# EAGLE design Droplet (EAGLE 6.1)
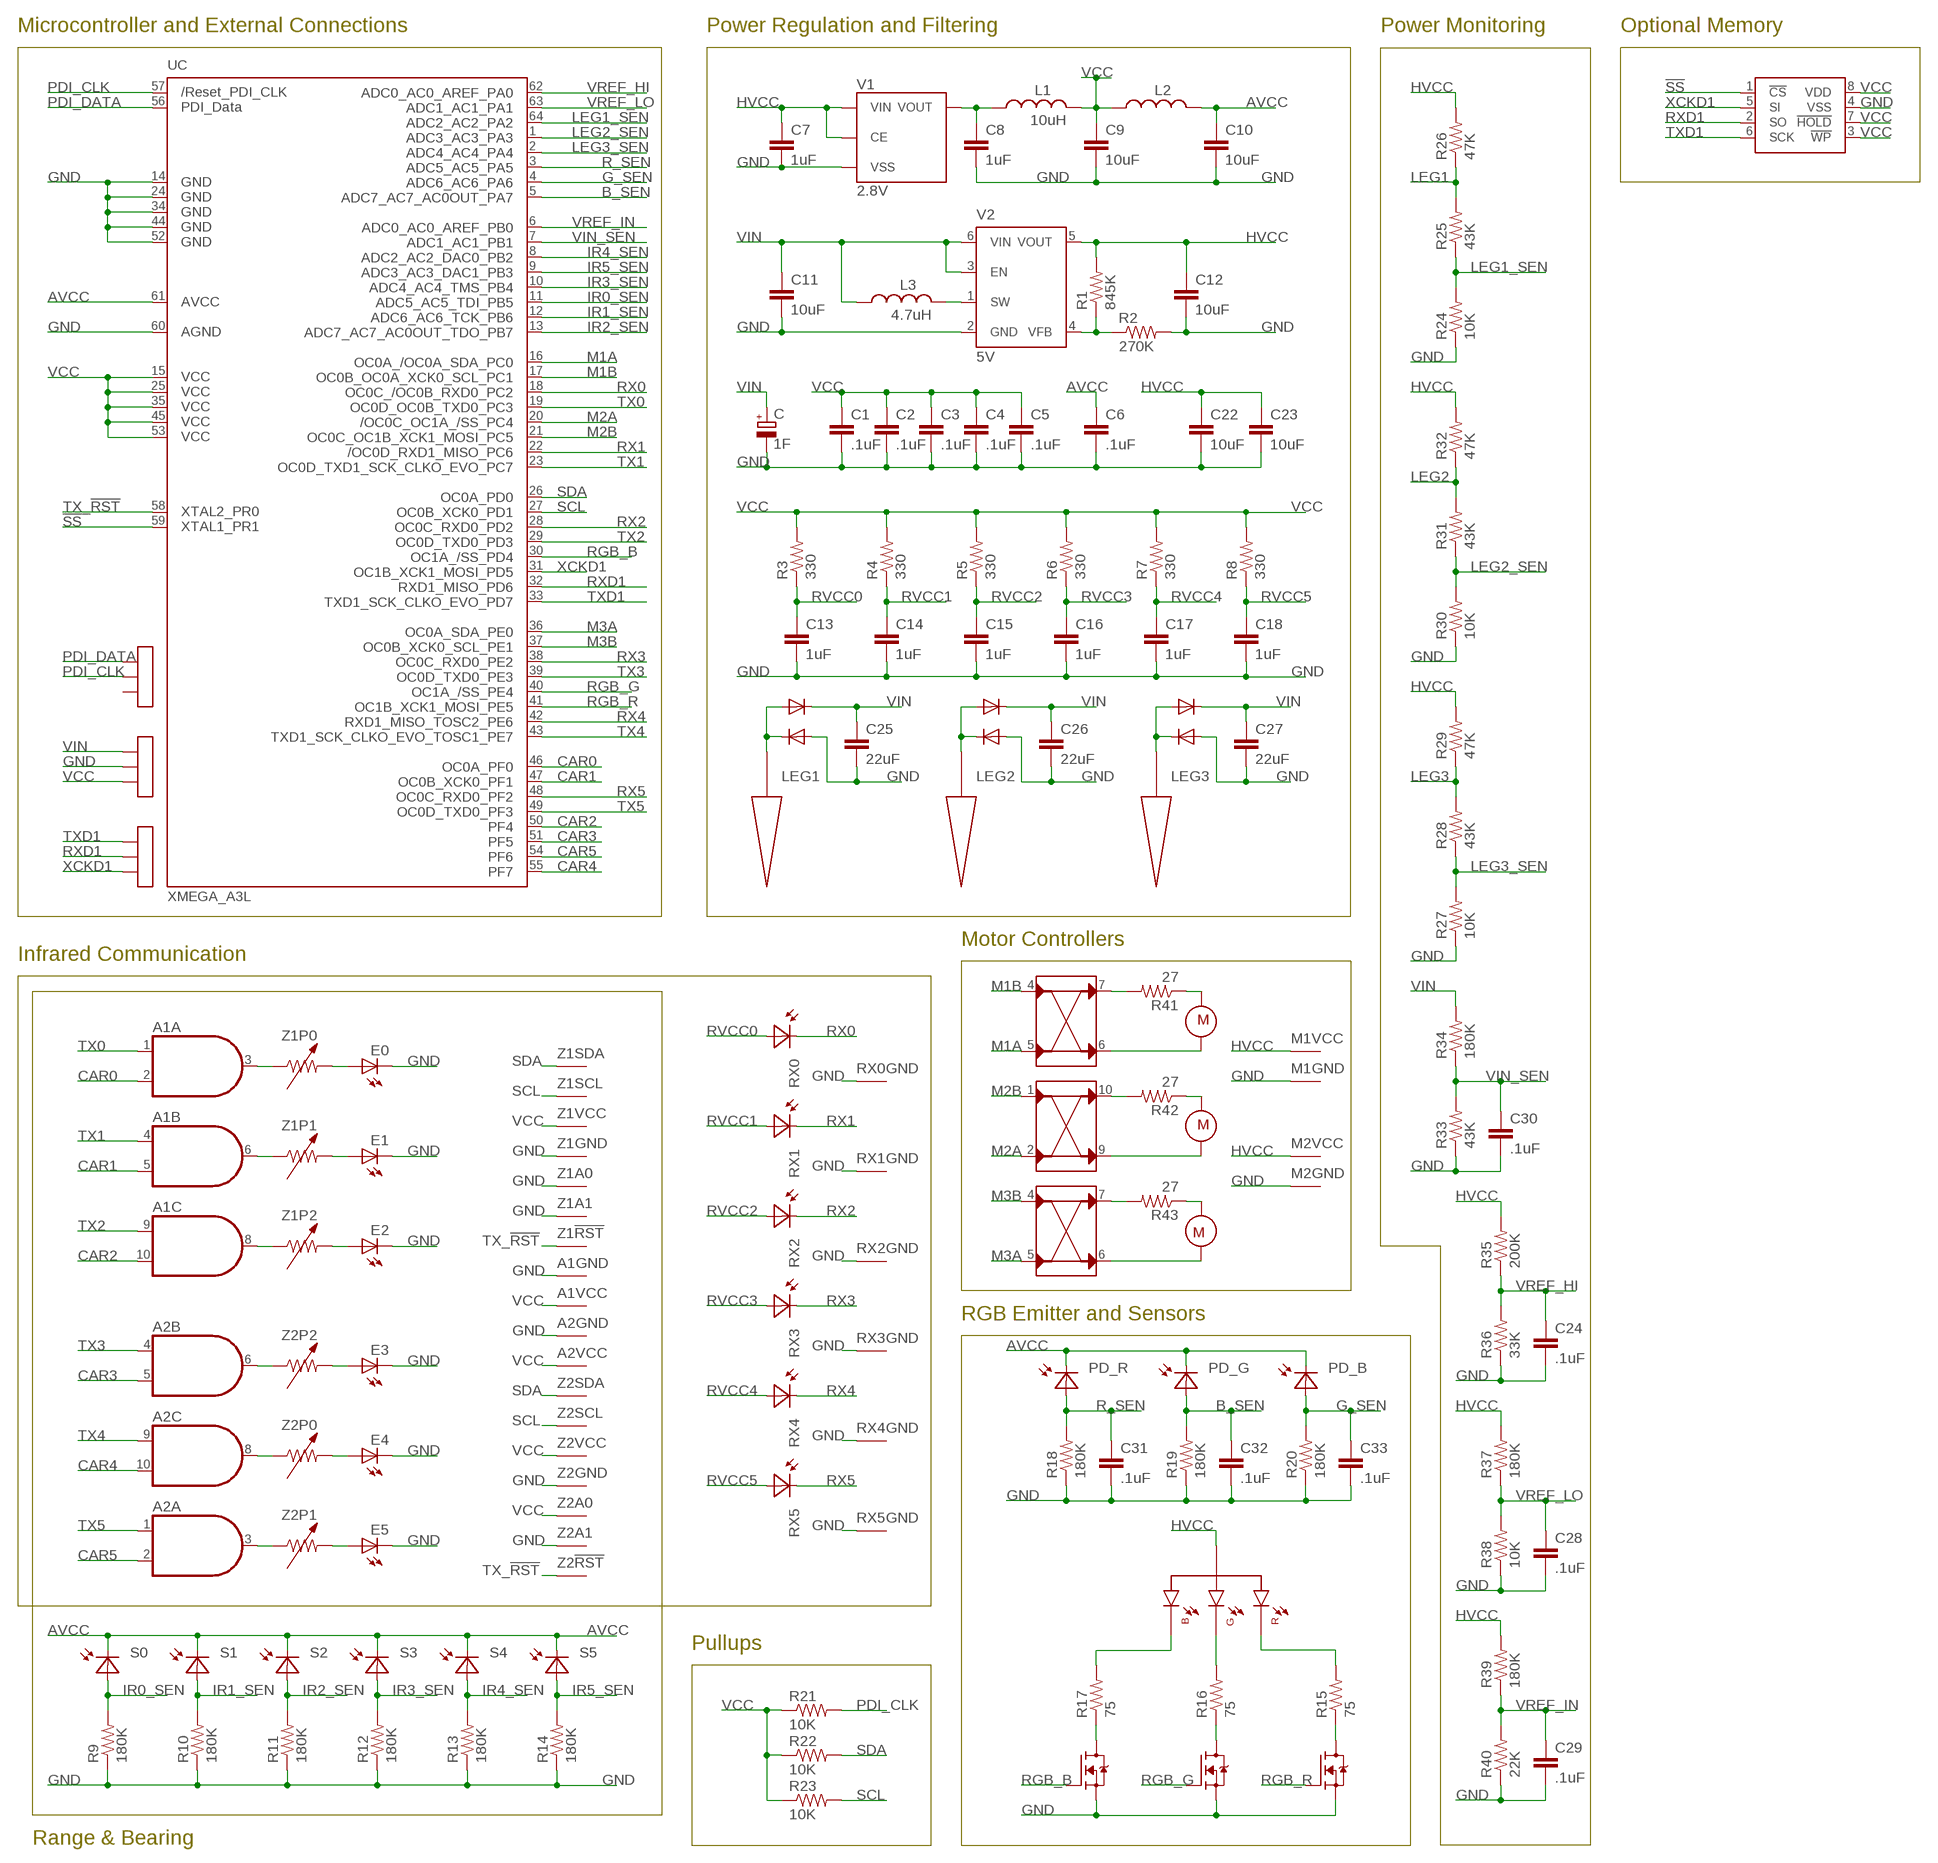
[diagram p0: schematic, sheet 1]

## Parts
A1  7408_X4"  [DHVQFN14-L]
A2  7408_X4"  [DHVQFN14-L]
C  1F  SUPERCAP  [SUPERCAP]
C1  .1uF  CAPACITOR0402  [0402]
C2  .1uF  CAPACITOR0402  [0402]
C3  .1uF  CAPACITOR0402  [0402]
C4  .1uF  CAPACITOR0402  [0402]
C5  .1uF  CAPACITOR0402  [0402]
C6  .1uF  CAPACITOR0402  [0402]
C7  1uF  CAPACITOR0402  [0402]
C8  1uF  CAPACITOR0402  [0402]
C9  10uF  CAPACITOR0603  [0603]
C10  10uF  CAPACITOR0603  [0603]
C11  10uF  CAPACITOR0603  [0603]
C12  10uF  CAPACITOR0603  [0603]
C13  1uF  CAPACITOR0402  [0402]
C14  1uF  CAPACITOR0402  [0402]
C15  1uF  CAPACITOR0402  [0402]
C16  1uF  CAPACITOR0402  [0402]
C17  1uF  CAPACITOR0402  [0402]
C18  1uF  CAPACITOR0402  [0402]
C22  10uF  CAPACITOR0603  [0603]
C23  10uF  CAPACITOR0603  [0603]
C24  .1uF  CAPACITOR0402  [0402]
C25  22uF  CAPACITOR0805  [0805]
C26  22uF  CAPACITOR0805  [0805]
C27  22uF  CAPACITOR0805  [0805]
C28  .1uF  CAPACITOR0402  [0402]
C29  .1uF  CAPACITOR0402  [0402]
C30  .1uF  CAPACITOR0402  [0402]
C31  .1uF  CAPACITOR0402  [0402]
C32  .1uF  CAPACITOR0402  [0402]
C33  .1uF  CAPACITOR0402  [0402]
D1  DIODE  [SOD-123]
D2  DIODE  [SOD-123]
D3  DIODE  [SOD-123]
D4  DIODE  [SOD-123]
D5  DIODE  [SOD-123]
D6  DIODE  [SOD-123]
E0  IR_LED  [1208-IR]
E1  IR_LED  [1208-IR]
E2  IR_LED  [1208-IR]
E3  IR_LED  [1208-IR]
E4  IR_LED  [1208-IR]
E5  IR_LED  [1208-IR]
F1  MOSFET-N_X2  [SOT-363]
F2  MOSFET-N_X2  [SOT-363]
L1  10uH  INDUCTOR0805  [0805]
L2  INDUCTOR0603  [0603]
L3  4.7uH  INDUCTOR  [1210]
LED  RGB_LED  [RGB_LED]
LEG1  LEG  [LEG]
LEG2  LEG  [LEG]
LEG3  LEG  [LEG]
M1  HALF-MOTOR_CONTROLLER  [DFN-10-EJ]
M2  HALF-MOTOR_CONTROLLER  [DFN-10-EJ]
MEM  MRAM  [DFN-8]
MOT1  MOTOR  [MOTOR_PADS]
MOT2  MOTOR  [MOTOR_PADS]
MOT3  MOTOR  [MOTOR_PADS]
P1  EDGE_PORT_3  [EDGE_CONNECTOR3]
P2  EDGE_PORT_3  [EDGE_CONNECTOR3]
P3  EDGE_PORT_3  [EDGE_CONNECTOR3]
PD_B  RGB_PHOTODIODE  [RGB_SENSOR]
PD_G  RGB_PHOTODIODE  [RGB_SENSOR]
PD_R  RGB_PHOTODIODE  [RGB_SENSOR]
R1  845K  RESISTOR  [0402]
R2  270K  RESISTOR  [0402]
R3  330  RESISTOR  [0402]
R4  330  RESISTOR  [0402]
R5  330  RESISTOR  [0402]
R6  330  RESISTOR  [0402]
R7  330  RESISTOR  [0402]
R8  330  RESISTOR  [0402]
R9  180K  RESISTOR  [0402]
R10  180K  RESISTOR  [0402]
R11  180K  RESISTOR  [0402]
R12  180K  RESISTOR  [0402]
R13  180K  RESISTOR  [0402]
R14  180K  RESISTOR  [0402]
R15  75  RESISTOR  [0402]
R16  75  RESISTOR  [0402]
R17  75  RESISTOR  [0402]
R18  180K  RESISTOR  [0402]
R19  180K  RESISTOR  [0402]
R20  180K  RESISTOR  [0402]
R21  10K  RESISTOR  [0402]
R22  10K  RESISTOR  [0402]
R23  10K  RESISTOR  [0402]
R24  10K  RESISTOR  [0402]
R25  43K  RESISTOR  [0402]
R26  47K  RESISTOR  [0402]
R27  10K  RESISTOR  [0402]
R28  43K  RESISTOR  [0402]
R29  47K  RESISTOR  [0402]
R30  10K  RESISTOR  [0402]
R31  43K  RESISTOR  [0402]
R32  47K  RESISTOR  [0402]
R33  43K  RESISTOR  [0402]
R34  180K  RESISTOR  [0402]
R35  200K  RESISTOR  [0402]
R36  33K  RESISTOR  [0402]
R37  180K  RESISTOR  [0402]
R38  10K  RESISTOR  [0402]
R39  180K  RESISTOR  [0402]
R40  22K  RESISTOR  [0402]
R41  27  RESISTOR  [0402]
R42  27  RESISTOR  [0402]
R43  27  RESISTOR  [0402]
RX0  IR_RECEIVER  [IR_RECEIVER]
RX1  IR_RECEIVER  [IR_RECEIVER]
RX2  IR_RECEIVER  [IR_RECEIVER]
RX3  IR_RECEIVER  [IR_RECEIVER]
RX4  IR_RECEIVER  [IR_RECEIVER]
RX5  IR_RECEIVER  [IR_RECEIVER]
S0  IR_PHOTODIODE  [1208-IR]
S1  IR_PHOTODIODE  [1208-IR]
S2  IR_PHOTODIODE  [1208-IR]
S3  IR_PHOTODIODE  [1208-IR]
S4  IR_PHOTODIODE  [1208-IR]
S5  IR_PHOTODIODE  [1208-IR]
UC  XMEGA_A3L  [MLF-64-L]
V1  2.8V  REGULATOR  [SOT-25]
V2  5V  REGULATOR_5V  [SOT-23-6]
Z1  VAR_RESISTOR_X4  [QFN-20]
Z2  VAR_RESISTOR_X4  [QFN-20]

## Nets
!SS: MEM.1(!CS) UC.59(PR1)
AVCC: C6.1 C10.1 L2.2 PD_B.C1(C) PD_B.C2(C) PD_G.C1(C) PD_G.C2(C) PD_R.C1(C) PD_R.C2(C) S0.C S1.C S2.C S3.C S4.C S5.C UC.61(AVCC)
B_SEN: C32.1 PD_G.A1(A) PD_G.A2(A) R19.2 UC.5(PA7)
CAR0: A1.2(A:I1) UC.46(PF0)
CAR1: A1.5(B:I1) UC.47(PF1)
CAR2: A1.10(C:I1) UC.50(PF4)
CAR3: A2.5(B:I1) UC.51(PF5)
CAR4: A2.10(C:I1) UC.55(PF7)
CAR5: A2.2(A:I1) UC.54(PF6)
G_SEN: C33.1 PD_B.A1(A) PD_B.A2(A) R20.2 UC.4(PA6)
GND: A1.7 A2.7 C1.2 C2.2 C3.2 C4.2 C5.2 C6.2 C7.2 C8.2 C9.2 C10.2 C11.2 C12.2 C13.2 C14.2 C15.2 C16.2 C17.2 C18.2 C22.2 C23.2 C24.2 C25.2 C26.2 C27.2 C28.2 C29.2 C30.2 C31.2 C32.2 C33.2 C.N(-) D2.A D4.A D6.A E0.C E1.C E2.C E3.C E4.C E5.C F1.1(S) F1.4(S) F2.1(S) M1.3 M2.3 MEM.4(VSS) P2.2A P2.2B R2.2 R9.1 R10.1 R11.1 R12.1 R13.1 R14.1 R18.1 R19.1 R20.1 R24.1 R27.1 R30.1 R33.1 R36.1 R38.1 R40.1 RX0.3 RX1.3 RX2.3 RX3.3 RX4.3 RX5.3 UC.14(GND1) UC.24(GND2) UC.34(GND3) UC.44(GND4) UC.52(GND5) UC.60(AGND) V1.VSS V2.2(GND) Z1.2 Z1.5 Z1.14 Z2.5 Z2.14
HVCC: C7.1 C12.1 C22.1 C23.1 LED.2(ANODE) M1.8 M2.8 R1.2 R26.2 R29.2 R32.2 R35.2 R37.2 R39.2 V1.CE V1.VIN V2.5(VOUT)
IR0_SEN: R9.2 S0.A UC.11(PB5)
IR1_SEN: R10.2 S1.A UC.12(PB6)
IR2_SEN: R11.2 S2.A UC.13(PB7)
IR3_SEN: R12.2 S3.A UC.10(PB4)
IR4_SEN: R13.2 S4.A UC.8(PB2)
IR5_SEN: R14.2 S5.A UC.9(PB3)
LEG1: D1.A D2.C LEG1.1 R25.2 R26.1
LEG1_SEN: R24.2 R25.1 UC.64(PA2)
LEG2: D3.A D4.C LEG2.1 R31.2 R32.1
LEG2_SEN: R30.2 R31.1 UC.1(PA3)
LEG3: D5.A D6.C LEG3.1 R28.2 R29.1
LEG3_SEN: R27.2 R28.1 UC.2(PA4)
M1A: M1.5(IN2) UC.16(PC0)
M1B: M1.4(IN1) UC.17(PC1)
M1Z: M1.6(OUT2) MOT1.2
M2A: M1.2(IN2) UC.20(PC4)
M2B: M1.1(IN1) UC.21(PC5)
M2Z: M1.9(OUT2) MOT2.2
M3A: M2.5(IN2) UC.36(PE0)
M3B: M2.4(IN1) UC.37(PE1)
M3Z: M2.6(OUT2) MOT3.1
N$1: C8.1 L1.1 V1.VOUT
N$2: R1.1 R2.1 V2.4(VFB)
N$3: E0.A Z1.10
N$4: E1.A Z1.7
N$5: E2.A Z1.17
N$6: L3.2 V2.1(SW)
N$7: E3.A Z2.17
N$8: E4.A Z2.10
N$9: E5.A Z2.7
N$10: A1.3(A:O) Z1.9
N$11: A1.6(B:O) Z1.8
N$12: A1.8(C:O) Z1.18
N$13: A2.6(B:O) Z2.18
N$14: A2.8(C:O) Z2.9
N$15: A2.3(A:O) Z2.8
N$16: F1.6(D) R17.1
N$17: F1.3(D) R16.1
N$18: F2.6(D) R15.1
N$19: LED.3(B) R17.2
N$20: LED.4(G) R16.2
N$21: M1.7(OUT1) R41.2
N$22: MOT1.1 R41.1
N$23: M1.10(OUT1) R42.2
N$24: MOT2.1 R42.1
N$25: LED.1(R) R15.2
N$26: M2.7(OUT1) R43.2
N$27: MOT3.2 R43.1
PDI_CLK: P1.2A P1.2B R21.2 UC.57(RESET)
PDI_DATA: P1.1A P1.1B UC.56(PDI_DATA)
R_SEN: C31.1 PD_R.A1(A) PD_R.A2(A) R18.2 UC.3(PA5)
RGB_B: F1.2(G) UC.30(PD4)
RGB_G: F1.5(G) UC.40(PE4)
RGB_R: F2.2(G) UC.41(PE5)
RVCC0: C13.1 R3.1 RX0.2(A)
RVCC1: C14.1 R4.1 RX1.2(A)
RVCC2: C15.1 R5.1 RX2.2(A)
RVCC3: C16.1 R6.1 RX3.2(A)
RVCC4: C17.1 R7.1 RX4.2(A)
RVCC5: C18.1 R8.1 RX5.2(A)
RX0: RX0.1(C) UC.18(PC2)
RX1: RX1.1(C) UC.22(PC6)
RX2: RX2.1(C) UC.28(PD2)
RX3: RX3.1(C) UC.38(PE2)
RX4: RX4.1(C) UC.42(PE6)
RX5: RX5.1(C) UC.48(PF2)
RXD1: MEM.2(SO) P3.2A P3.2B UC.32(PD6)
SCL: R23.2 UC.27(PD1) Z1.3 Z2.3
SDA: R22.2 UC.26(PD0) Z1.4 Z2.4
TX0: A1.1(A:I0) UC.19(PC3)
TX1: A1.4(B:I0) UC.23(PC7)
TX2: A1.9(C:I0) UC.29(PD3)
TX3: A2.4(B:I0) UC.39(PE3)
TX4: A2.9(C:I0) UC.43(PE7)
TX5: A2.1(A:I0) UC.49(PF3)
TX_!RST: UC.58(PR0) Z1.13 Z2.13
TXD1: MEM.6(SCK) P3.1A P3.1B UC.33(PD7)
VCC: A1.14 A2.14 C1.1 C2.1 C3.1 C4.1 C5.1 C9.1 L1.2 L2.1 MEM.3(!WP) MEM.7(!HOLD) MEM.8(VDD) P2.3A P2.3B R3.2 R4.2 R5.2 R6.2 R7.2 R8.2 R21.1 R22.1 R23.1 UC.15(VCC1) UC.25(VCC2) UC.35(VCC3) UC.45(VCC4) UC.53(VCC5) Z1.15 Z2.2 Z2.15
VIN: C11.1 C25.1 C26.1 C27.1 C.P(+) D1.C D3.C D5.C L3.1 P2.1A P2.1B R34.2 V2.3(EN) V2.6(VIN)
VIN_SEN: C30.1 R33.2 R34.1 UC.7(PB1)
VREF_HI: C24.1 R35.1 R36.2 UC.62(PA0)
VREF_IN: C29.1 R39.1 R40.2 UC.6(PB0)
VREF_LO: C28.1 R37.1 R38.2 UC.63(PA1)
XCKD1: MEM.5(SI) P3.3A P3.3B UC.31(PD5)
Unconnected: A1.11(D:O) A1.12(D:I0) A1.13(D:I1) A2.11(D:O) A2.12(D:I0) A2.13(D:I1) F2.3(D) F2.4(S) F2.5(G) M2.1(IN1) M2.2(IN2) M2.9(OUT2) M2.10(OUT1) P1.3A P1.3B Z1.19 Z1.20 Z2.19 Z2.20

## Notes on the sheet
- Microcontroller and External Connections | Power Regulation and Filtering | Power Monitoring | Optional Memory
- Motor Controllers
- Infrared Communication
- RGB Emitter and Sensors
- Pullups
- Range & Bearing

## Library data of the parts
A1 = Droplet:7408_X4; DIGIKEY: 568-2993-1-ND
A2 = Droplet:7408_X4
C = Droplet:SUPERCAP
C1-C18 C22-C33 = Droplet:CAPACITOR
D1-D6 = Droplet:DIODE
E0 E1-E5 = Droplet:IR_LED
F1 F2 = Droplet:MOSFET-N_X2
L1-L3 = Droplet:INDUCTOR
LED = Droplet:RGB_LED
LEG1-LEG3 = Droplet:LEG
M1 M2 = Droplet:HALF-MOTOR_CONTROLLER
MEM = Droplet:MRAM
MOT1-MOT3 = Droplet:MOTOR
P1-P3 = Droplet:EDGE_PORT_3
PD_B PD_G PD_R = Droplet:RGB_PHOTODIODE
R1-R43 = Droplet:RESISTOR
RX0 RX1-RX5 = Droplet:IR_RECEIVER
S0 S1-S5 = Droplet:IR_PHOTODIODE
UC = Droplet:XMEGA_A3
V1 = Droplet:REGULATOR
V2 = Droplet:REGULATOR_5V
Z1 Z2 = Droplet:VAR_RESISTOR_X4

## Board
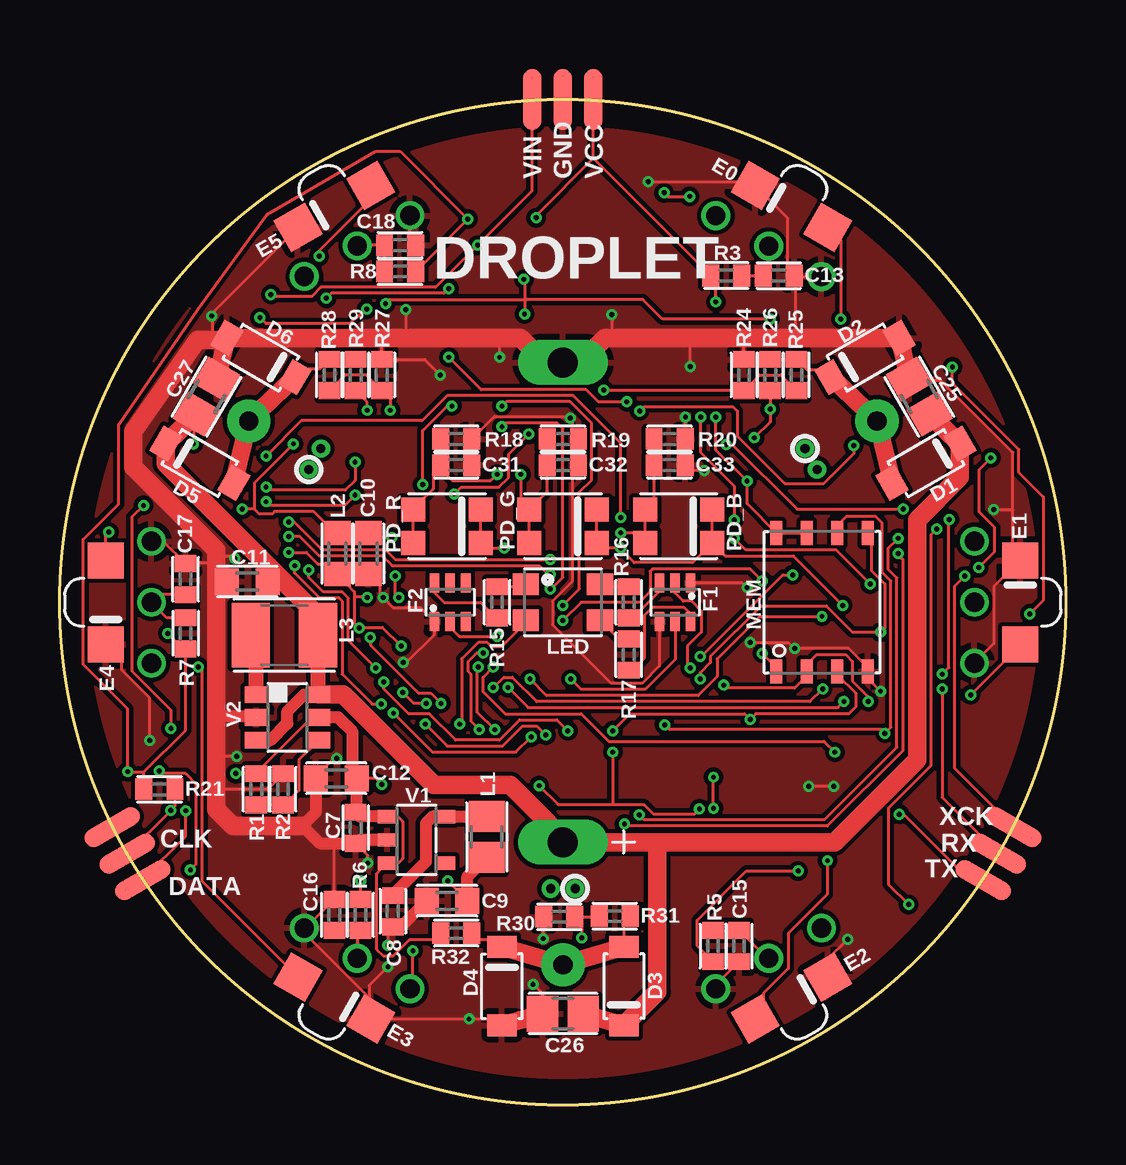
[diagram p1: board, top side]
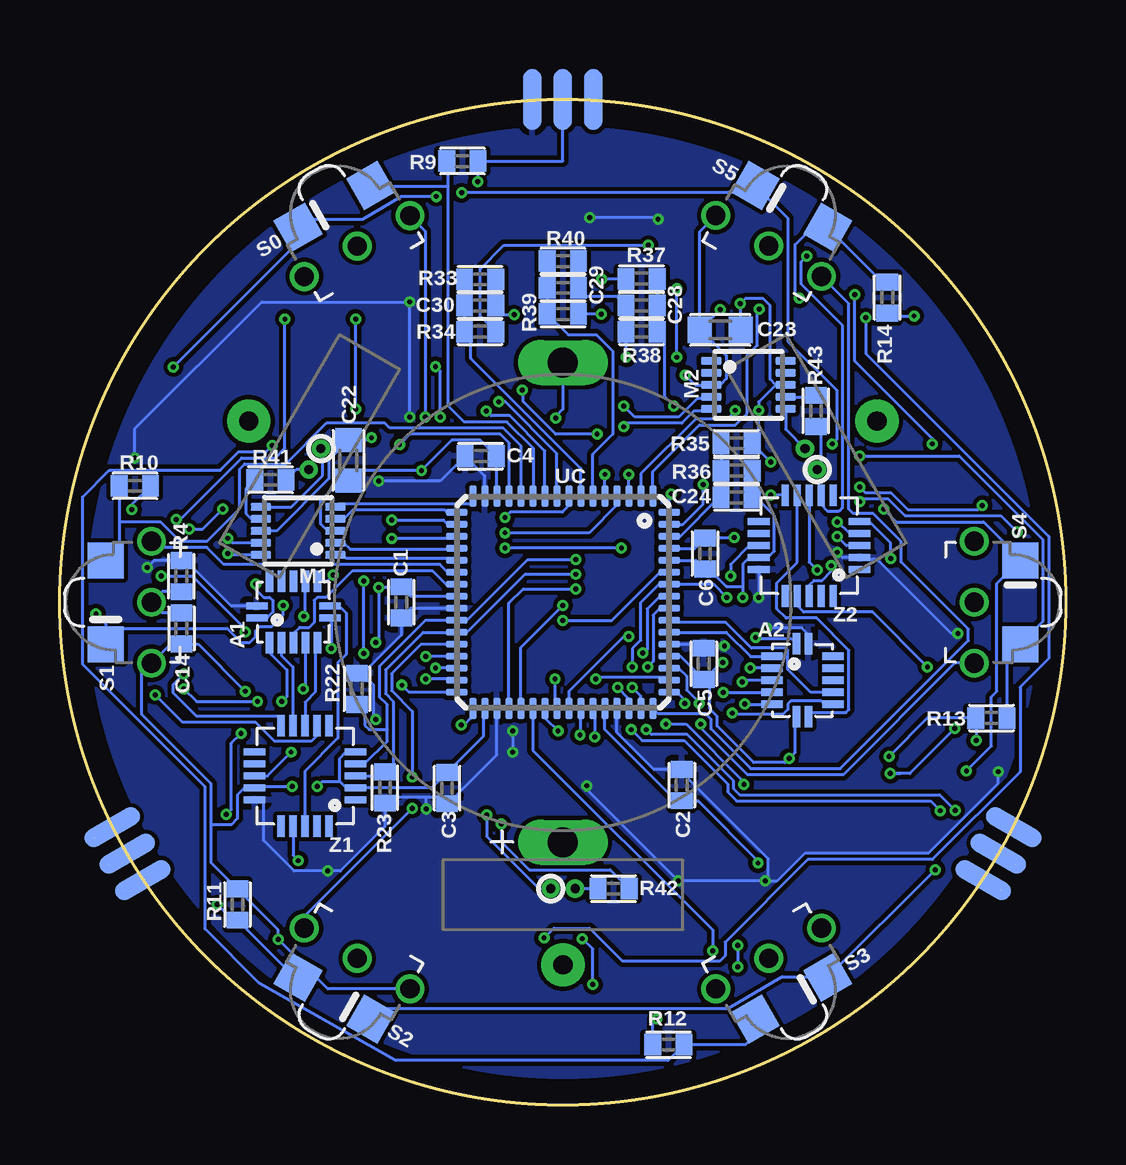
[diagram p2: board, bottom side, seen from below]

Size 41.91 x 41.91 mm. Coordinates in mm from the lower left corner, seen from the top.
Outline: circle at 20.95,20.95 radius 20.95
Copper layers (1*16): Top 0.035mm / dielectric 1.5mm / Bottom 0.035mm
Design rules: minimum track width 5mil, minimum drill 8mil, track to track 5mil, track to pad 5mil, pad to pad 7mil, via to via 5mil, smd to smd 7mil, copper to edge 40mil, drill to drill 8mil, minimum pad ring 5mil, minimum via ring 5mil, stop-mask expansion 4mil, vias tented up to drill 12mm, thermal gap 10mil
tKeepout: area 0.6,0.6 to 41.3,41.3
bKeepout: area 0.6,0.6 to 41.3,41.3

### Footprints (pad centres in the part's own frame; a part is rotated, then mirrored left to right if it is on the bottom)
DHVQFN14-L = smd 0.9 x 0.3: 1 -1.525,-0.25; 7 1.525,-0.25; 8 1.525,0.25; 14 -1.525,0.25 | smd 0.3 x 0.9: 2 -1,-1.275; 3 -0.5,-1.275; 4 0,-1.275; 5 0.5,-1.275; 6 1,-1.275; 9 1,1.275; 10 0.5,1.275; 11 0,1.275; 12 -0.5,1.275; 13 -1,1.275
SUPERCAP = drill 1.25 long: N -10,0; P 10,0
0402 = smd 0.7 x 0.9: 1 -0.65,0; 2 0.65,0
0603 = smd 1 x 1.1: 1 -0.85,0; 2 0.85,0
0805 = smd 1.3 x 1.5: 1 -0.85,0; 2 0.85,0
SOD-123 = smd 0.91 x 1.22: A -1.635,0; C 1.635,0
1208-IR = smd 1.5 x 1.5: A -1.75,0; C 1.75,0
SOT-363 = smd 0.4 x 0.8: 1 -0.65,-0.8; 2 0,-0.8; 3 0.65,-0.8; 4 0.65,0.8; 5 0,0.8; 6 -0.65,0.8
1210 = smd 1.6 x 2.7: 1 -1.4,0; 2 1.4,0
RGB_LED = smd 1.1 x 0.9: 1 -1.55,0.75; 2 -1.55,-0.75; 3 1.55,-0.75; 4 1.55,0.75
LEG = drill 0.8 pad 1.8: 1 0,0
DFN-10-EJ = smd 0.3 x 0.85: 1 -0.97,-1.54; 2 -0.47,-1.54; 3 0.03,-1.54; 4 0.53,-1.54; 5 1.03,-1.54; 6 1.03,1.56; 7 0.53,1.56; 8 0.03,1.56; 9 -0.47,1.56; 10 -0.97,1.56
DFN-8 = smd 1 x 0.5: 1 -2.89,1.905; 2 -2.89,0.635; 3 -2.89,-0.635; 4 -2.89,-1.905; 5 2.89,-1.905; 6 2.89,-0.635; 7 2.89,0.635; 8 2.89,1.905
MOTOR_PADS = drill 0.381 pad 0.762: 1 -0.508,0.254; 2 0.508,0.254
EDGE_CONNECTOR3 = smd 0.762 x 2.54: 1A -1.27,0; 2A 0,0; 3A 1.27,0 | smd 0.762 x 2.54 bottom: 1B -1.27,0; 2B 0,0; 3B 1.27,0
RGB_SENSOR = smd 1 x 1: A1 -1.4,0.7; A2 -1.4,-0.7; C1 1.4,0.7; C2 1.4,-0.7
IR_RECEIVER = drill 0.8: 1 -2.54,0; 2 0,0; 3 2.54,0
MLF-64-L = smd 0.9 x 0.3: 1 -4.425,3.75; 2 -4.425,3.25; 3 -4.425,2.75; 4 -4.425,2.25; 5 -4.425,1.75; 6 -4.425,1.25; 7 -4.425,0.75; 8 -4.425,0.25; 9 -4.425,-0.25; 10 -4.425,-0.75; 11 -4.425,-1.25; 12 -4.425,-1.75; 13 -4.425,-2.25; 14 -4.425,-2.75; 15 -4.425,-3.25; 16 -4.425,-3.75; 33 4.425,-3.75; 34 4.425,-3.25; 35 4.425,-2.75; 36 4.425,-2.25; 37 4.425,-1.75; 38 4.425,-1.25; 39 4.425,-0.75; 40 4.425,-0.25; 41 4.425,0.25; 42 4.425,0.75; 43 4.425,1.25; 44 4.425,1.75; 45 4.425,2.25; 46 4.425,2.75; 47 4.425,3.25; 48 4.425,3.75 | smd 0.3 x 0.9: 17 -3.75,-4.425; 18 -3.25,-4.425; 19 -2.75,-4.425; 20 -2.25,-4.425; 21 -1.75,-4.425; 22 -1.25,-4.425; 23 -0.75,-4.425; 24 -0.25,-4.425; 25 0.25,-4.425; 26 0.75,-4.425; 27 1.25,-4.425; 28 1.75,-4.425; 29 2.25,-4.425; 30 2.75,-4.425; 31 3.25,-4.425; 32 3.75,-4.425; 49 3.75,4.425; 50 3.25,4.425; 51 2.75,4.425; 52 2.25,4.425; 53 1.75,4.425; 54 1.25,4.425; 55 0.75,4.425; 56 0.25,4.425; 57 -0.25,4.425; 58 -0.75,4.425; 59 -1.25,4.425; 60 -1.75,4.425; 61 -2.25,4.425; 62 -2.75,4.425; 63 -3.25,4.425; 64 -3.75,4.425
SOT-25 = smd 0.8 x 0.55: CE -1.22,-0.97; NC 1.22,-0.97; VIN -1.22,0.97; VOUT 1.22,0.97; VSS -1.22,0
SOT-23-6 = smd 0.69 x 0.99: 1 -0.95,-1.29; 2 0,-1.29; 3 0.95,-1.29; 4 0.95,1.3; 5 0,1.3; 6 -0.95,1.3
QFN-20 = smd 0.9 x 0.3: 1 -2.1,1; 2 -2.1,0.5; 3 -2.1,0; 4 -2.1,-0.5; 5 -2.1,-1; 11 2.1,-1; 12 2.1,-0.5; 13 2.1,0; 14 2.1,0.5; 15 2.1,1 | smd 0.3 x 0.9: 6 -1,-2.1; 7 -0.5,-2.1; 8 0,-2.1; 9 0.5,-2.1; 10 1,-2.1; 16 1,2.1; 17 0.5,2.1; 18 0,2.1; 19 -0.5,2.1; 20 -1,2.1

### Placement (x,y rotation side)
A1  32.18,20.55 0 bottom
A2  10.97,17.7 270 bottom
C  20.95,20.95 270 bottom
C1  27.69,20.95 90 bottom
C2  16,13.34 270 bottom
C3  25.78,13.21 90 bottom
C4  24.38,27.05 0 bottom
C5  15.09,18.39 270 bottom
C6  15.04,22.99 270 bottom
C7  12.32,11.56 270 top
C8  13.87,8.08 270 top
C9  16.13,8.51 180 top
C10  12.85,22.99 270 top
C11  7.8,21.82 180 top
C12  11.51,13.61 180 top
C13  29.95,34.57 0 top
C14  36.86,19.86 270 bottom
C15  28.3,6.63 270 top
C16  11.43,7.92 90 top
C17  5.23,21.92 90 top
C18  14.17,35.84 0 top
C22  29.9,26.87 270 bottom
C23  14.4,32.31 180 bottom
C24  13.72,25.32 0 bottom
C25  35.8,29.53 120 top
C26  20.95,3.81 180 top
C27  6.11,29.53 60 top
C28  17.68,33.32 180 bottom
C29  20.95,34.06 0 bottom
C30  24.41,33.32 0 bottom
C31  16.51,26.67 0 top
C32  20.95,26.67 0 top
C33  25.4,26.67 0 top
D1  36.08,26.76 30 top
D2  33.54,31.16 210 top
D3  23.5,4.95 270 top
D4  18.41,4.95 90 top
D5  5.83,26.76 150 top
D6  8.37,31.16 330 top
E0  30.48,37.45 150 top
E1  40.01,20.95 90 top
E2  30.48,4.46 30 top
E3  11.43,4.46 330 top
E4  1.91,20.95 270 top
E5  11.43,37.45 210 top
F1  25.63,20.95 180 top
F2  16.26,20.95 0 top
L1  17.78,11.18 270 top
L2  11.56,22.99 90 top
L3  9.35,19.58 180 top
LED  20.95,20.95 0 top
LEG1  34.04,28.51 0 bottom
LEG2  20.95,5.84 180 bottom
LEG3  7.87,28.51 0 bottom
M1  31.98,23.9 90 bottom
M2  13.23,30.05 270 bottom
MEM  31.75,20.95 90 top
MOT1  31.51,27.05 120 top
MOT2  20.95,8.76 0 top
MOT3  10.4,27.05 240 top
P1  2.81,10.48 120 top
P2  20.95,41.91 0 top
P3  39.1,10.48 60 top
PD_B  25.78,24.13 0 top
PD_G  20.95,24.13 0 top
PD_R  16.13,24.13 0 top
R1  8.18,13.16 90 top
R2  9.3,13.16 90 top
R3  27.76,34.57 180 top
R4  36.86,22.05 90 bottom
R5  27.2,6.63 270 top
R6  12.52,7.92 90 top
R7  5.23,19.66 270 top
R8  14.17,34.75 0 top
R9  25.15,39.34 180 bottom
R10  38.79,25.81 180 bottom
R11  34.52,8.36 270 bottom
R12  16.56,2.51 0 bottom
R13  3.1,16.13 0 bottom
R14  7.44,33.66 90 bottom
R15  18.21,20.95 90 top
R16  23.7,20.95 90 top
R17  23.7,18.77 90 top
R18  16.51,27.76 180 top
R19  20.95,27.76 180 top
R20  25.4,27.76 180 top
R21  4.14,13.16 0 top
R22  29.54,17.35 270 bottom
R23  28.37,13.23 90 bottom
R24  28.5,30.43 270 top
R25  30.68,30.43 90 top
R26  29.59,30.43 270 top
R27  13.41,30.43 270 top
R28  11.23,30.43 90 top
R29  12.32,30.43 270 top
R30  20.8,7.85 0 top
R31  23.11,7.87 0 top
R32  16.51,7.16 180 top
R33  24.41,34.42 180 bottom
R34  24.41,32.23 0 bottom
R35  13.72,27.58 0 bottom
R36  13.72,26.44 180 bottom
R37  17.68,34.44 180 bottom
R38  17.68,32.23 0 bottom
R39  20.95,32.97 0 bottom
R40  20.95,35.18 180 bottom
R41  33.15,26.06 180 bottom
R42  18.85,9.02 0 bottom
R43  10.41,28.93 90 bottom
RX0  29.53,35.8 210 bottom
RX1  38.1,20.95 270 bottom
RX2  29.53,6.11 330 bottom
RX3  12.38,6.11 30 bottom
RX4  3.81,20.95 90 bottom
RX5  12.38,35.81 150 bottom
S0  30.48,37.45 210 bottom
S1  40.01,20.95 270 bottom
S2  30.48,4.46 330 bottom
S3  11.43,4.46 30 bottom
S4  1.91,20.95 90 bottom
S5  11.43,37.45 150 bottom
UC  20.95,20.95 270 bottom
V1  14.86,11.05 0 top
V2  9.47,16.15 270 top
Z1  31.7,13.72 180 bottom
Z2  10.69,23.32 180 bottom

### Tracks (layer width: path | path; a pad name or v marks a point on that pad's centre or on a via)
!SS  (via drill 0.2)
  Top 0.127: MEM.1 29.84,18.24 v29.26,18.82 | v20.95,20.19 21.72,20.95 24.13,20.95 24.59,21.41 24.59,22.25 24.69,22.35 28.75,22.35 v29.26,21.84
  Bottom 0.127: v29.26,18.82 v29.26,21.84 | v20.95,20.19 18.92,20.19 16.91,22.2 UC.59
AVCC  (via drill 0.2)
  Top 0.127: PD_R.C1 PD_R.C2 17.74,23.22 v18.52,23.22 | PD_G.C1 PD_G.C2 22.44,23.34 22.45,23.34 22.58,23.22 v23.37,23.22 23.37,23.16 23.93,22.61 26.36,22.61 PD_B.C2 | PD_B.C2 PD_B.C1 | v13.82,23.65 13.03,23.65 12.85,23.82 C10.1 L2.2 11.54,23.85 11.46,23.85 10.57,24.74 8.94,24.74 8.87,24.66 8.28,24.66 8.1,24.84 | 8.1,24.84 v7.59,24.84 | v9.73,27.56 8.1,25.93 8.1,24.84 | PD_B.C2 27.73,22.89 30.56,22.89 v32.61,20.83 | v4.14,13.92 4.24,13.82 5.23,13.82 5.66,13.39 5.66,10.03 v5.44,9.8 | v25.17,38.02 25.32,37.87 v26.24,37.87 | v40.41,20.47 40.97,21.03 40.97,25.35 39.95,26.36 39.95,27.33 37.19,30.1 v37.19,30.76
  Bottom 0.127: v13.82,23.65 13.85,23.64 C6.1 15.47,23.2 UC.61 | v7.59,24.84 7.06,24.31 3.43,24.31 2.41,23.29 2.41,23.27 1.88,22.73 S4.C 2.87,21.74 2.87,17.25 3.1,17.02 3.1,14.96 v4.14,13.92 | v9.73,27.56 9.55,27.74 9.55,29.79 11.58,31.83 11.58,36.97 S5.C 13.25,38.02 v25.17,38.02 | v18.52,23.22 v23.37,23.22 | v5.44,9.8 S3.C 11.78,5.33 11.79,5.33 11.84,5.33 14.07,4.04 28.51,4.04 S2.C | v32.61,20.83 32.61,20.42 33.1,19.94 33.58,19.94 33.76,19.76 33.76,19.53 34.01,19.28 34.37,19.28 34.95,19.86 39.35,19.86 S1.C 40.01,20.07 v40.41,20.47 | v26.24,37.87 27.69,37.87 29.31,36.91 31.67,36.91 S0.C 32,35.95 v37.19,30.76
B_SEN  (via drill 0.2)
  Top 0.127: PD_G.A2 PD_G.A1 | R19.2 C32.1 20.3,25.58 PD_G.A1 | v19.2,26.29 19.2,25.22 19.56,24.87 19.55,24.86 PD_G.A1
  Bottom 0.127: UC.5 v19.2,26.29
CAR0  (via drill 0.2)
  Top 0.127: v18.67,17.4 19.51,16.56 32.41,16.56 v32.66,16.82
  Bottom 0.127: UC.46 18.2,16.93 v18.67,17.4 | A1.2 33.18,18.86 32.46,18.14 32.46,17.02 v32.66,16.82
CAR1  (via drill 0.2)
  Top 0.127: v18.06,17.4 18.49,17.83 18.85,17.83 19.86,16.82 31.24,16.82 v31.77,17.35
  Bottom 0.127: UC.47 17.7,17.05 v18.06,17.4 | A1.5 31.68,17.44 v31.77,17.35
CAR2  (via drill 0.2)
  Top 0.127: v31.75,20.37 29.16,20.37 27.38,18.59 27.38,17.86 26.59,17.07 20.27,17.07 v19.58,17.75
  Bottom 0.127: A1.10 31.68,20.44 v31.75,20.37 | UC.50 16.66,17.83 19.51,17.83 v19.58,17.75
CAR3  (via drill 0.2)
  Top 0.127: v15.27,16.74 14.73,16.74 v14.28,17.2
  Bottom 0.127: UC.51 16.12,18.2 15.8,17.88 15.8,17.3 15.34,16.84 15.34,16.82 v15.27,16.74 | A2.5 12.28,17.17 14.28,17.17 v14.28,17.2
CAR4
  Bottom 0.127: A2.10 10.62,17.2 11.58,18.16 11.58,18.95 11.68,19.05 13.11,19.05 14.17,20.12 16.44,20.12 UC.55
CAR5
  Bottom 0.127: UC.54 14.14,19.7 13.13,18.69 A2.2
G_SEN  (via drill 0.2)
  Top 0.127: R20.2 C33.1 24.75,25.2 PD_B.A1 PD_B.A2 24.37,23.44 24.36,23.44 23.95,23.85 v23.37,23.85
  Bottom 0.127: UC.4 18.69,25.02 19.86,23.85 v23.37,23.85
GND  (via drill 0.2)  (1 unrouted)
  Top 0.127: R2.2 9.3,13.79 8.66,13.16 6.5,13.16 | V2.2 7.9,16.15 | RX4.3 4.31,23.5 C17.2 5.27,22.61 6.5,22.61 | C15.2 27.33,5.01 RX2.3 | 30.63,34.53 C13.2 30.33,34.84 30.33,36.97 E0.C 28.81,38.48 v24.51,38.48 | 30.63,34.53 RX0.3 | C18.2 14.58,36.08 RX5.3 | C31.2 R18.1 18.1,28.7 21.18,28.7 v21.26,28.63 21.34,28.55 21.34,28.03 R19.1 21.59,27.74 21.59,26.68 C32.2 21.34,26.4 21.34,21.82 20.52,21.01 20.52,20.02 22.96,17.58 24.26,17.58 24.98,18.3 F1.4 | C12.2 10.82,13.78 10.82,13.87 11.4,14.45 v11.53,14.45 | v7.29,22.78 7.29,22.86 6.5,22.86 | C10.2 12.89,22.14 13.34,21.69 13.34,21.29 v13.46,21.16 13.89,20.73 15.04,20.73 F2.1 15.61,19.62 14.43,18.44 v14.3,18.44 | E2.C 32,6.09 v32.82,6.91 | D4.A 18.15,3.58 v17.04,3.58 E3.C 12.95,4.4 | 11.28,10.91 11.43,10.76 C16.2 10.23,7.38 RX3.3 10.18,7.17 12.95,4.4 | C26.2 20.11,4.63 v19.71,5.03 | v20.14,6.93 20.14,7.77 20.17,7.8 | 20.17,7.8 20.17,7.87 | R30.1 20.15,7.81 20.17,7.8 | v12.83,10.08 12.83,10.4 C7.2 | v7.37,14.53 6.53,14.53 6.5,14.5 | 6.35,31.88 6.35,32.87 v6.33,32.89 6.33,32.99 E5.C | 8.18,31.98 8.17,31.97 8.15,31.97 | v18.31,31.17 18.31,31.97 | v32.23,13.28 v31.19,13.28 | v22.99,32.94 22.99,31.97 | v14.4,33.15 14.4,31.93 | v28.63,21.57 28.43,21.75 F1.1 | v3.73,15.19 3.73,16.97 2.56,18.14 2.56,18.8 2.31,18.8 E4.C | RX1.3 38.91,19.23 38.91,21.61 E1.C 39.7,23.01 39.7,24.82 | v34.19,17.25 33.66,17.78 MEM.4 33.66,18.24 32.87,19.02 v30.61,19.02 30.35,19.28 v28.75,19.28 | v26.85,26.44 26.21,26.44 26.16,26.49 26.16,26.56 C33.2 R20.1 26.05,28.67 v26.06,28.68 | v15.85,30.43 15.2,31.08 R27.1 13.41,31.93 | 13.41,31.93 13.46,31.98 | 13.41,31.93 13.39,31.95 13.41,31.97
  Top 0.127: v26.26,30.79 26.26,31.97 | R24.1 28.5,31.97 | 30.63,34.53 30.63,32.02 30.58,31.97 | C8.2 13.66,7.22 v13.66,6.66 | v13.66,5.77 12.88,4.98 12.88,4.37 | 12.88,4.37 12.88,4.01 | 12.95,4.4 12.91,4.37 12.88,4.37 | 39.7,24.82 39.7,27.2 36.7,30.2 35.44,30.2 C25.2 | v38.91,24.82 39.7,24.82 | P2.2B 20.95,42.88
  Top 0.508: V1.VSS 12.46,11.05 C7.2 11.28,10.91 10.83,10.91 10.1,11.63 10.66,12.19 C12.2 10.41,13.37 | 6.86,31.88 D6.A | D6.A | D6.A 6.99,32 | V2.2 8.13,16.2 6.5,16.2 | C8.2 14.2,7.43 C9.2
  Top 0.635: 22.7,31.97 22.73,32
  Top 0.762: C25.2 D2.A 30.58,31.97 28.5,31.97 26.26,31.97 22.99,31.97 22.7,31.97 21.68,30.95 C.N 20.23,30.95 19.21,31.97 18.31,31.97 13.41,31.97 8.15,31.97 D6.A C27.2 | D4.A C26.2 | 6.86,31.88 6.35,31.88 5.71,31.88 3.05,28.07 3.05,26.59 6.5,23.14 6.5,22.86 6.5,22.61 6.5,21.84 | 10.1,11.63 7.19,11.63 6.5,12.32 6.5,13.16 6.5,14.5 6.5,16.2 6.5,21.84 | C11.2 6.92,21.84 6.5,21.84
  Bottom 0.127: UC.14 23.73,25.41 C4.2 24.39,27.71 25.58,27.71 v26.85,26.44 29.44,26.44 29.77,26.11 29.84,26.11 29.9,26.06 C22.2 30.21,26.02 31.06,25.17 31.06,24.23 30.79,23.95 30.46,23.95 M1.3 | UC.24 27.29,21.2 C1.2 27.73,21.57 v28.63,21.57 28.63,19.41 v28.75,19.28 | UC.34 24.2,16.43 24.26,16.38 24.26,15.38 C3.2 26.41,13.23 29.58,13.23 Z1.2 29.98,13.22 30.25,13.49 | UC.44 19.2,15.65 16.24,12.69 C2.2 15.33,12.69 12.83,10.19 v12.83,10.08 | 30.25,13.49 30.25,14.45 30,14.71 29.61,14.71 Z1.5 | UC.52 16.05,18.7 C5.2 | A2.7 11.3,16.1 11.3,14.68 v11.53,14.45 11.71,14.28 13.01,14.28 14.53,15.8 14.53,16.2 14.83,16.51 14.83,17.49 C5.2 | Z2.5 8.19,24.32 7.32,23.44 v7.29,22.78 | UC.60 15.4,22.7 C6.2 14.87,22.34 14.15,21.61 13.49,21.61 13.46,21.59 v13.46,21.16 13.46,22.55 13.2,22.82 Z2.14 12.41,22.82 12.14,23.09 12.14,24.56 12.88,25.3 13.04,25.3 C24.2 13.08,25.34 13.08,26.43 R36.1 | v38.91,24.82 38.91,25.03 R10.1 | R12.1 17.21,3.42 v17.04,3.58 | v19.71,5.03 19.71,6.5 v20.14,6.93 | v7.37,14.53 5.77,16.13 R13.1 3.73,16.11 v3.73,15.19 | R14.1 7.41,32.89 v6.33,32.89 | C.N 20.95,29.01 21.26,28.7 v21.26,28.63 | C23.2 15.25,36.41 RX5.3 | R33.1 C30.2 23.38,32.94 v22.99,32.94 | v18.31,31.17 18.33,31.18 R38.1 C28.2 18.71,33.71 19.95,33.71 C29.2 20.3,34.07 20.32,34.09 20.3,34.1 R40.1 | v32.23,13.28 33.73,13.28 Z1.14 34.23,13.22 34.52,12.93 34.52,11.94 34.77,11.68 35.61,11.68 | v31.19,13.28 30.99,13.49 30.25,13.49 | v24.51,38.48 24.5,38.5 R9.1 20.95,39.34 P2.2B 20.95,42.88 | RX2.3 30.75,4.84 v32.82,6.91 32.82,7.3 R11.1 35.61,10.1 35.61,11.68 | C23.2 v14.4,33.15 | C23.2 15.18,32.23 15.14,32.23 14.15,31.24 14.15,30.28 14.41,30.02 M2.3 15.44,30.02 v15.85,30.43
  Bottom 0.127: v34.19,17.25 36.16,19.21 C14.2 37.3,19.21 RX1.3 38.2,18.41 38.51,18.11 38.51,16.28 35.61,13.39 35.61,11.68 | v26.06,28.68 26.06,30.58 v26.26,30.79 | A1.7 30.61,20.25 v30.61,19.02 | v13.66,6.66 v13.66,5.77 | C5.2 15.05,17.74 14.35,18.44 v14.3,18.44
  pour Top (isolate 0.178): 0.38,20.95 0.38,21.08 arc-90 20.95,41.66 arc-90 41.66,20.95 arc-90 21.08,0.38 20.95,0.38 arc-90
HVCC  (via drill 0.2)
  Top 0.127: R1.2 8.18,13.84 | 8.18,13.84 10.49,16.15 V2.5 | V1.VIN 14.07,12.02 14.28,11.81 14.28,10.26 14.09,10.08 V1.CE 13.21,9.65 13.21,6.48 13.46,6.22 13.89,6.22 14.55,6.88 15.58,6.88 R32.2 | v12.8,28.96 12.8,29.3 R29.2 | v19.33,34.42 19.36,34.39 19.36,33.58 | 19.36,33.58 19.36,33.55 | 19.36,33.55 v19.36,32.97 | 19.36,33.55 19.33,33.58 13.74,33.58 v13.56,33.4 | R26.2 v29.59,29.01 29.59,28.47 v28.93,27.81 | LED.2 19.41,20.12 18.39,19.1 17.98,19.1 17.8,19.28 17.42,19.28 16.74,18.59 16.74,15.95 v16.66,15.88 | v13.41,13.36 13.16,13.61 C12.1 | v12.29,26.8 12.29,26.04 11.89,25.63 8.71,25.63 v8.59,25.76 | v3.48,24.99 3,24.51 3,18.09 4.62,16.46 v4.62,15.7 | 8.18,13.84 8.15,13.82 v7.32,13.82 | v29.59,32.77 25.09,32.77 24.28,33.58 19.36,33.58
  Top 0.508: V1.VIN 12.51,12.02 C7.1 12.36,12.24 C12.1 12.19,13.78 12.19,15.54 11.58,16.15 V2.5
  Bottom 0.127: M1.8 32.89,23.93 30.71,26.11 30.71,26.87 29.95,27.64 29.95,27.67 C22.1 29.87,27.74 29.01,27.74 v28.93,27.81 | M2.8 12.09,30.02 | 13.55,32.22 C23.1 v13.55,33.39 v13.56,33.4 13.36,33.6 12.6,33.6 12.32,33.33 12.32,30.25 12.09,30.02 | 12.09,30.02 12.8,29.3 v12.8,28.96 12.8,27.85 R35.2 13.07,27.57 v12.29,26.8 | R37.2 18.35,34.42 v19.33,34.42 | v19.36,32.97 R39.2 | v16.66,15.88 15.82,15.88 13.41,13.46 v13.41,13.36 | v8.59,25.76 8.36,25.53 7.29,25.53 6.58,24.82 3.66,24.82 v3.48,24.99 | 6.88,13.82 v7.32,13.82 6.5,13.82 v4.62,15.7 | v29.59,29.01 v29.59,32.77
IR0_SEN
  Bottom 0.127: R9.2 25.53,39.08 25.76,38.85 25.76,38.3 | 25.76,38.3 25.76,29.16 25.07,28.47 23.29,28.47 22.2,27.38 UC.11 | S0.A 28.94,38.3 25.76,38.3
IR1_SEN
  Bottom 0.127: 39.44,24.28 R10.2 39.45,25.83 | 39.44,24.28 39.44,23.27 S1.A | 39.44,24.28 39.41,24.31 37.72,24.31 36.91,23.5 35.79,23.5 34.42,24.87 34.42,26.52 34.21,26.72 32.51,26.72 30.81,28.42 28.37,28.42 28.17,28.22 23.44,28.22 22.71,27.48 UC.12
IR2_SEN  (via drill 0.2)
  Top 0.127: v36.52,24 36.3,23.77 36.3,14.15 34.52,12.37 34.52,9.2 v35.36,8.36 | v35.13,24.84 30.71,24.84 28.02,27.53 v27.76,27.53
  Bottom 0.127: S2.A 32.14,5.33 R11.2 34.71,7.71 v35.36,8.36 | UC.13 23.19,25.39 23.19,27.58 23.57,27.96 27.33,27.96 v27.76,27.53 27.58,27.71 | v36.52,24 35.97,24 v35.13,24.84
IR3_SEN  (via drill 0.2)
  Top 0.127: v33.07,27.48 33.07,27.15 31.83,25.91 30.2,25.91 28.22,27.89 28.22,28.93 28.04,29.11 24.33,29.11 v24.16,28.93
  Bottom 0.127: S3.A 13.06,3.47 13.06,2.82 13.36,2.52 R12.2 16.57,1.85 27.94,1.85 33.6,5.08 35.87,7.34 35.87,13.26 40.97,18.36 40.97,25.35 39.85,26.47 35.23,26.47 34.47,27.23 33.33,27.23 v33.07,27.48 | UC.10 21.7,27.27 23.16,28.73 23.95,28.73 v24.16,28.93
IR4_SEN  (via drill 0.2)
  Top 0.127: v23.37,24.49 23.37,27.58 21.39,29.57 16.13,29.57 15.09,28.52 10.06,28.52 v8.59,27.05
  Bottom 0.127: R13.2 2.45,18.66 S4.A 0.96,20.14 0.96,23.57 4.45,27.05 v8.59,27.05 | UC.8 20.7,24.99 20.98,24.71 23.14,24.71 v23.37,24.49
IR5_SEN  (via drill 0.2)
  Top 0.127: v11.1,33.63 11.3,33.83 16,33.83 v16.2,34.04 | v23.62,29.31 22.43,29.31 21.92,29.82 17.55,29.82 v16.2,31.17
  Bottom 0.127: R14.2 7.64,34.3 S5.A 10.17,36.32 10.82,36.32 11.28,35.87 11.28,33.81 v11.1,33.63 | UC.9 21.2,27.15 23.37,29.31 v23.62,29.31 | v16.2,31.17 v16.2,34.04
LEG1
  Top 0.127: D2.C 31.94,30.34 31.62,30.66 31.11,30.66 R25.2 R26.1
  Top 0.762: D1.A LEG1.1 D2.C
LEG1_SEN  (via drill 0.2)
  Top 0.127: R25.1 30.03,30.43 29.15,30.43 R24.2 22.67,29.78 v22.66,29.79 | v16.43,25.48 16.71,25.76 18.29,25.76 18.69,26.16 18.69,27.13 v19.53,27.96
  Bottom 0.127: UC.64 16.53,25.38 v16.43,25.48 | 22.61,29.74 v22.66,29.79 22.66,29.77 22.61,29.72 22.61,29.31 21.26,27.96 v19.53,27.96
LEG2
  Top 0.127: R31.2 23.5,7.61 D3.A | R32.1 17.41,6.91 18.24,6.91 18.36,6.78 18.36,6.6 18.38,6.59 D4.C
  Top 0.762: D4.C LEG2.1 D3.A
LEG2_SEN  (via drill 0.2)
  Top 0.127: R31.1 22.43,7.87 22.4,7.85 R30.2 21.74,7.56 v21.74,6.96 | v12.78,33.17 12.27,32.77 12.06,32.56 8.59,32.56 v8.33,32.82
  Bottom 0.127: UC.1 17.2,26.41 15.27,28.35 13.77,28.35 13.28,28.83 13.28,31.24 12.85,31.67 12.85,33.1 v12.78,33.17 | v8.33,32.82 8.33,31.32 0.71,23.7 0.71,18.62 1.91,17.42 1.91,13.89 5.56,10.24 10.74,10.24 14.2,6.78 14.2,6.22 14.43,5.99 18.47,5.99 19.84,7.37 21.34,7.37 v21.74,6.96
LEG3
  Top 0.127: D6.C 9.86,30.41 9.86,30.43 10.11,30.43 10.36,30.68 10.83,30.68 R28.2 R29.1
  Top 0.762: D6.C LEG3.1 D5.A
LEG3_SEN  (via drill 0.2)
  Top 0.127: R28.1 11.88,30.43 12.76,30.43 R27.2 13.77,29.42 v13.77,28.96
  Bottom 0.127: UC.2 17.7,26.31 15.42,28.6 14.1,28.6 13.77,28.93 v13.77,28.96
M1A
  Bottom 0.127: M1.5 30.3,25.07 24.82,25.07 24.7,25.18 UC.16
M1B
  Bottom 0.127: M1.4 30.08,24.43 29.69,24.82 25.88,24.82 25.77,24.7 UC.17
M1Z
  Bottom 0.127: M1.6 32.27,24.93 30.96,26.24 30.96,27.29 MOT1.2
M2A
  Bottom 0.127: M1.2 30.09,23.43 29.82,23.16 25.42,23.16 UC.20
M2B
  Bottom 0.127: M1.1 30.42,22.91 30.1,22.91 29.97,22.78 25.46,22.78 UC.21
M2Z  (via drill 0.2)
  Top 0.127: v34.92,23.62 34.49,23.19 34.49,22.35 34.87,21.97 34.87,14.91 31.85,11.89 24.33,11.89 v24.13,12.09
  Bottom 0.127: v24.13,12.09 24.13,11.2 21.95,9.02 MOT2.2 | M1.9 34.73,23.43 v34.92,23.62
M3A  (via drill 0.2)
  Top 0.127: v18.41,28.27 18.57,28.42 20.73,28.42 20.95,28.19 20.95,22 20.47,21.51 v20.42,21.51
  Bottom 0.127: UC.36 23.2,20.91 22.61,21.51 v20.42,21.51 | M2.5 14.86,28.93 15.49,28.93 16,28.42 18.26,28.42 v18.41,28.27
M3B  (via drill 0.2)
  Top 0.127: v20.95,20.83 21.64,21.51 21.64,25.55 22.15,26.06 22.15,28.42 21.26,29.31 18.59,29.31 v18.41,29.13
  Bottom 0.127: UC.37 22.7,19.08 v20.95,20.83 | M2.4 14.85,29.44 15.37,29.44 16.13,28.68 17.96,28.68 v18.41,29.13
M3Z
  Bottom 0.127: M2.6 11.67,28.17 MOT3.1
N$1
  Top 0.508: L1.1 V1.VOUT 15.52,12.02 15.24,11.73 15.24,10.13 13.87,8.76 C8.1
N$2
  Top 0.127: V2.4 9.96,14.39 9.96,13.11 9.42,12.57 9.36,12.57 R2.1 R1.1
N$3  (via drill 0.2)
  Top 0.127: v36.75,17.96 37.03,18.24 37.03,24.38 v37.06,24.41 | E0.A 32.54,36.04 v32.54,32.77
  Bottom 0.127: Z1.10 32.7,16.14 32.72,16.15 32.72,16.2 36.22,16.2 37.19,17.17 37.19,17.53 v36.75,17.96 | v37.06,24.41 36.91,24.41 34.34,26.98 32.94,26.98 32.54,27.38 v32.54,32.77
N$4  (via drill 0.2)
  Top 0.127: v37.95,17.09 40.01,19.15 E1.A
  Bottom 0.127: Z1.7 31.2,15.41 31.45,15.16 32.97,15.16 33.76,15.95 36.8,15.95 v37.95,17.09
N$5  (via drill 0.2)
  Top 0.127: v31.98,10.19 31.98,8.79 30.35,7.16 30.35,5.69 29.31,4.65 29.31,3.93 E2.A
  Bottom 0.127: Z1.17 32.2,10.41 v31.98,10.19
N$6
  Top 0.635: V2.1 8.18,19.35
  Top 0.762: 8.18,19.35 L3.2
N$7  (via drill 0.2)
  Top 0.127: E3.A 5.92,9.33 5.92,18.11 v5.77,18.26
  Bottom 0.127: v5.77,18.26 8.05,20.55 10.92,20.55 11.19,20.82 Z2.17
N$8  (via drill 0.2)
  Top 0.127: v12.29,25.43 11.86,24.99 8.74,24.99 v8.59,25.15 | E4.A 1.91,23.75 v2.03,23.88
  Bottom 0.127: Z2.10 12.31,25.42 v12.29,25.43 | v8.59,25.15 8.51,25.22 8.51,25.27 7.42,25.27 6.71,24.56 2.72,24.56 v2.03,23.88
N$9  (via drill 0.2)
  Top 0.127: E5.A 12.95,37.76 10.79,35.61 v10.79,35.38
  Bottom 0.127: Z2.7 10.19,25.03 9.93,24.77 9.45,24.77 9.3,24.92 9.3,32.49 11.02,34.21 11.02,35.15 v10.79,35.38
N$10
  Bottom 0.127: A1.3 32.68,18.74 32.21,18.26 Z1.9
N$11
  Bottom 0.127: A1.6 31.27,19.19 31.27,17.22 31.7,16.79 Z1.8
N$12
  Bottom 0.127: Z1.18 31.7,13.92 30.33,15.29 30.33,18.44 29.97,18.8 29.97,20.5 30.18,20.7 30.5,20.7 30.61,20.8 A1.8
N$13  (via drill 0.2)
  Top 0.127: v13.39,16.71 13.01,16.71 11.76,17.96 11.76,21.01 11.63,21.13 10.82,21.13 9.78,22.17 v9.78,22.48
  Bottom 0.127: v13.39,16.71 13.38,16.7 A2.6 | 10.69,21.59 Z2.18 10.69,21.67 10.49,21.87 10.16,21.87 9.78,22.25 v9.78,22.48
N$14
  Bottom 0.127: A2.8 10.54,16.36 9.17,16.36 9.04,16.48 9.04,18.95 10.39,20.3 11.66,20.3 12.04,20.68 12.04,21.77 11.19,22.61 Z2.9
N$15  (via drill 0.2)
  Top 0.127: v13.16,18.21 12.01,19.36 12.01,21.13 11.76,21.39 10.97,21.39 10.36,22 v10.36,22.3
  Bottom 0.127: A2.3 12.26,18.21 v13.16,18.21 | Z2.8 10.69,22.63 v10.36,22.3
N$16
  Top 0.127: R17.1 23.84,18.12 24.36,18.64 24.36,20.42 24.69,20.75 25.98,20.75 26.28,20.46 F1.6
N$17
  Top 0.127: F1.3 24.98,21.59 24.97,21.59 24.97,21.49 24.97,21.44 24.97,21.41 23.86,20.3 R16.1
N$18
  Top 0.127: F2.6 15.61,21.35 16,20.95 17.53,20.95 18.18,20.3 R15.1
N$19
  Top 0.127: R17.2 23.29,19.42 LED.3
N$20
  Top 0.127: R16.2 22.61,21.61 LED.4
N$21
  Bottom 0.127: R41.2 34.16,25.69 34.16,24.66 33.93,24.43 M1.7
N$22
  Bottom 0.127: MOT1.1 32.07,26.48 R41.1
N$23  (via drill 0.2)
  Top 0.127: v34.92,22.99 35.05,22.81 35.13,22.73 35.13,14.78 31.98,11.63 23.6,11.63 v23.52,11.71
  Bottom 0.127: M1.10 34.92,22.93 v34.92,22.99 | v23.52,11.71 23.52,10.97 22.35,9.8 18.98,9.8 R42.2
N$24
  Bottom 0.127: R42.1 MOT2.1
N$25
  Top 0.127: R15.2 19.29,21.61 19.33,21.64 19.34,21.64 LED.1
N$26
  Bottom 0.127: M2.7 10.48,29.52 R43.2
N$27
  Bottom 0.127: R43.1 10.21,28.08 10.21,26.64 MOT3.2
PDI_CLK  (via drill 0.2)  (1 unrouted)
  Top 0.127: R21.2 4.79,12.46 v4.61,12.28 4.62,12.27 2.83,10.48 P1.2B 2.36,10.03 2.08,10.03 | v17.63,18.85 17.37,18.85 16.99,18.47 16.99,18.09 17.12,17.96 17.12,16 v17.48,15.65
  Bottom 0.127: UC.57 16.92,21.2 17.45,20.68 17.45,18.97 17.58,18.85 v17.63,18.85 | v17.48,15.65 17.27,15.44 15.77,15.44 13.84,13.51 13.84,13.18 13.59,12.93 5.26,12.93 v4.61,12.28 | 2.08,10.03 2.53,10.48 P1.2B
PDI_DATA  (via drill 0.2)  (1 unrouted)
  Top 0.127: v17.42,18.26 17.37,18.21 17.37,16.38 v18.11,15.65 | v5.23,12.27 5.23,11.2 3.45,9.42 3.45,9.39 P1.1B 3.13,9.38 2.72,8.97
  Bottom 0.127: UC.56 16.91,20.7 17.2,20.42 17.2,18.49 v17.42,18.26 | v18.11,15.65 17.65,15.19 15.9,15.19 14.1,13.39 14.1,13.06 13.72,12.68 5.64,12.68 v5.23,12.27 | P1.1B 3.03,8.97 2.72,8.97
R_SEN  (via drill 0.2)
  Top 0.127: PD_R.A2 PD_R.A1 14.91,25.01 14.91,25.04 15.54,25.68 15.54,26.29 15.85,26.59 | R18.2 15.86,27.73 15.88,27.71 15.88,26.68 C31.1 15.85,26.59 | v18.21,26.29 17.93,26.01 16.36,26.01 15.85,26.52 15.85,26.59
  Bottom 0.127: UC.3 v18.2,26.28 v18.21,26.29
RGB_B  (via drill 0.2)
  Top 0.127: F1.2 25.63,21.34 25.96,21.01 26.31,21.01 26.72,20.6 26.72,19.71 26.14,19.13 26.14,18.34 v26.26,18.21
  Bottom 0.127: UC.30 25.39,18.21 v26.26,18.21
RGB_G  (via drill 0.2)
  Top 0.127: F1.5 25.63,18.57 24.38,17.32 21.72,17.32 v21.29,17.75
  Bottom 0.127: v21.29,17.75 21.29,16.66 21.2,16.58 UC.40
RGB_R  (via drill 0.2)
  Top 0.127: F2.2 16.26,19.91 16.64,19.53 v18.21,19.53
  Bottom 0.127: UC.41 20.7,17.24 18.41,19.53 v18.21,19.53
RVCC0
  Top 0.127: RX0.2 29.52,35.79 29.52,34.79 C13.1 R3.1
RVCC1
  Bottom 0.127: R4.1 37.66,21.4 RX1.2 37.66,20.51 C14.1
RVCC2
  Top 0.127: R5.1 27.22,7.26 28.28,7.26 C15.1 29.47,6.11 RX2.2
RVCC3
  Top 0.127: C16.1 R6.1 12.38,7.13 RX3.2
RVCC4
  Top 0.127: R7.1 4.46,20.31 RX4.2 4.12,21.27 C17.1
RVCC5
  Top 0.127: R8.1 C18.1 12.41,35.84 RX5.2
RX0  (via drill 0.2)
  Top 0.127: v28.09,24.38 28.09,25.81 26.7,27.2 v26.7,28.68
  Bottom 0.127: RX0.1 27.3,37.05 27.3,37.03 26.7,36.42 v26.7,28.68 | v28.09,24.38 25.93,24.38 25.75,24.2 UC.18
RX1
  Bottom 0.127: UC.22 25.43,22.2 25.48,22.25 25.81,22.25 26.09,22.53 35.08,22.53 35.79,23.24 37.85,23.24 RX1.1
RX2  (via drill 0.2)
  Top 0.127: v27.23,12.37 v27.23,13.66
  Bottom 0.127: UC.28 26.87,19.2 28.09,17.98 28.09,17.27 27.23,16.41 v27.23,13.66 27.23,13.82 | v27.23,12.37 31.88,7.72 31.73,7.57 RX2.1
RX3  (via drill 0.2)
  Top 0.127: RX3.1 14.6,4.86 14.71,4.96 v14.71,6.43
  Bottom 0.127: UC.38 22.2,14.79 14.71,7.29 v14.71,6.43
RX4  (via drill 0.2)
  Top 0.127: v15.21,15.88 16.13,14.96 18.44,14.96 19.28,15.8 19.86,15.8 v20.24,15.42 20.24,15.47
  Bottom 0.127: RX4.1 4.62,18.41 9.27,13.77 13.26,13.77 15.21,15.72 v15.21,15.88 | UC.42 20.2,15.46 v20.24,15.42
RX5
  Bottom 0.127: 16.98,16.31 UC.48 17.2,16.52 16.99,16.31 15.01,16.31 14.78,16.08 14.78,15.67 13.13,14.02 9.4,14.02 4.06,19.36 4.06,19.84 6.86,22.63 6.86,23.5 8.03,24.66 8.87,24.66 9.04,24.84 9.04,33.4 RX5.1 | RX5.1 | RX5.1
RXD1  (via drill 0.2)  (1 unrouted)
  Top 0.127: v27.66,17.5 27.79,17.37 30.61,17.37 31.11,17.88 MEM.2 31.11,18.36 31.52,18.77 32.74,18.77 33.02,18.49 33.02,17.68 33.68,17.02 v33.68,16.82 | v36.75,17.35 36.75,12.83 38.33,11.25 P3.2B 39.43,10.48 39.88,10.03
  Bottom 0.127: UC.32 27.36,17.2 v27.66,17.5 | v36.75,17.35 36.22,16.82 v33.68,16.82 | P3.2B 39.55,10.03 39.88,10.03
SCL  (via drill 0.2)
  Top 0.127: v9.53,23.7 9.98,23.7 10.79,22.89 13.44,22.89 13.84,22.48 19.96,22.48 20.32,22.12 v20.42,22.12
  Bottom 0.127: Z1.3 28.6,13.72 28.43,13.88 R23.2 | Z2.3 9.14,23.32 v9.53,23.7 | 28.19,14.06 R23.2 | R23.2 28.02,14.24 28.02,16.82 28.35,17.14 28.35,18.14 26.78,19.7 UC.27 24.94,19.71 22.53,22.12 v20.42,22.12
SDA  (via drill 0.2)
  Top 0.127: v20.42,22.73 13.97,22.73 13.56,23.14 10.92,23.14 9.75,24.31 v9.53,24.31 9.5,24.31
  Bottom 0.127: Z1.4 29.55,14.22 29.52,14.25 29.18,14.25 28.27,15.16 28.27,15.65 | Z2.4 9.01,23.82 9.5,24.31 v9.53,24.31 | 28.27,15.65 28.27,16.69 28.6,17.02 28.6,18.29 26.68,20.2 UC.26 24.98,20.2 24.97,20.19 22.43,22.73 v20.42,22.73 | R22.2 29.5,16.7 29.21,16.41 29.21,15.82 29.03,15.65 28.27,15.65
TX0  (via drill 0.2)
  Top 0.127: v33.76,21.72 32.33,23.14 28.57,23.14 v28.09,23.62
  Bottom 0.127: UC.19 25.46,23.62 v28.09,23.62 | 34.09,20.3 A1.1 33.69,20.32 33.27,20.32 33.05,20.55 33.05,21.03 33.17,21.16 33.43,21.16 33.76,21.49 v33.76,21.72
TX1
  Bottom 0.127: UC.23 25.82,21.7 26.39,22.28 29.72,22.28 30.84,21.16 31.19,21.16 31.32,21.03 31.32,20.12 31.52,19.91 31.93,19.91 32.18,19.66 A1.4
TX2  (via drill 0.2)
  Top 0.127: v26.67,18.69 26.72,18.69 30.12,22.1 v30.53,22.1
  Bottom 0.127: UC.29 v26.67,18.69 | v30.53,22.1 30.8,21.82 A1.9
TX3  (via drill 0.2)
  Top 0.127: v13.49,17.63 13.49,17.35 14.53,16.31 15.39,16.31 16.48,15.21 18.31,15.21 19.15,16.05 20.7,16.05 v21.16,15.6
  Bottom 0.127: UC.39 21.7,16.14 v21.16,15.6 | A2.4 13.41,17.7 v13.49,17.63
TX4  (via drill 0.2)
  Top 0.127: v13.89,16.33 15.52,14.71 19,14.71 v19.63,15.34
  Bottom 0.127: A2.9 9.78,16.79 10.13,16.79 10.19,16.84 11.46,16.84 11.58,16.71 11.58,16.48 11.79,16.28 13.89,16.28 v13.89,16.33 | UC.43 19.63,16.45 v19.63,15.34
TX5  (via drill 0.2)
  Top 0.127: 15.9,16.84 15.88,16.82 v15.88,16.74 15.44,17.17 14.94,17.17 12.93,19.18 v12.93,19.48
  Bottom 0.127: A2.1 11.43,19.43 12.9,19.43 12.93,19.46 v12.93,19.48 | UC.49 16.19,17.2 15.88,16.89 v15.88,16.74
TX_!RST  (via drill 0.2)
  Top 0.127: v14.12,21.16 13.97,21.31 v13.97,22.05 | v18.06,18.26 17.63,17.83 17.63,17.22 18.54,16.31 21.72,16.31 22.86,15.16 31.83,15.16 v32.28,14.71
  Bottom 0.127: Z2.13 13.18,23.32 13.97,22.53 v13.97,22.05 | v14.12,21.16 14.66,21.69 16.52,21.69 UC.58 16.95,21.7 17.7,20.95 17.7,19.38 18.06,19.02 v18.06,18.26 | Z1.13 33.27,13.72 v32.28,14.71
TXD1  (via drill 0.2)  (1 unrouted)
  Top 0.127: MEM.6 32.56,24.02 32.56,24.33 32.77,24.54 33.98,24.54 34.24,24.28 34.24,22.23 34.62,21.84 34.62,15.75 v34.37,15.49 34.21,15.65 25.4,15.65 v25.2,15.85 | v34.98,12.12 35.15,12.12 37.39,9.88 37.97,9.88 P3.1B 38.9,8.94 39.22,8.94
  Bottom 0.127: UC.33 24.7,16.47 24.79,16.38 24.79,16.13 25.07,15.85 v25.2,15.85 | v34.98,12.12 34.77,12.32 34.77,15.09 v34.37,15.49 | 39.22,8.94 38.78,9.38 P3.1B
VCC  (via drill 0.2)  (1 unrouted)
  Top 0.127: 12.27,21.18 12.27,21.39 11.99,21.67 11.99,21.7 L2.1 11.24,22.45 11.12,22.45 11.12,22.48 11.05,22.55 10.74,22.55 10.26,23.04 v9.53,23.04 | 12.27,21.18 12.27,20.09 v12.47,19.89 12.5,19.91 13.44,19.91 v14.22,19.13 | v12.8,21.16 12.7,21.16 12.68,21.18 12.27,21.18 | R21.1 3.49,13.88 | 3.49,13.88 5.23,15.62 R7.2 5.15,19.01 v4.5,19.66 | R5.2 26.54,6.64 26.54,7.7 28.6,9.75 v30.76,9.75 | MEM.7 MEM.8 28.63,25.06 v28.63,26.01 27.33,27.3 v27.33,28.68 | 22.23,39.46 R3.2 27.11,34.51 27.33,34.29 v27.33,33.48 | 22.23,39.46 P2.3B 22.23,42.85 | R8.2 16.99,36.92 v16.99,36.93 14.17,39.75 13.16,39.75 8.61,37.11 5.77,33.2 2.44,28.37 2.44,25.04 0.96,23.57 0.96,18.36 2.82,16.51 v2.82,13.89 2.83,13.88 3.49,13.88 | 22.23,39.46 19.84,37.07 v19.84,36.98 | R6.2 v12.52,9.35 | v16.15,9.35 16.98,8.52 C9.1 | MEM.3 32.38,17.93 33.15,17.17 33.15,16.59 32.87,16.31 28.98,16.31 v28.75,16.08 28.52,16.31 23.75,16.31 v23.04,15.6 | v19.96,13.31 20.75,12.52 23.09,12.52 | 23.09,12.52 24.33,12.52 24.71,12.14 26.44,12.14 v26.64,12.34 | v23.04,14.71 23.04,12.57 23.09,12.52 | v38.28,22.4 38.94,23.06 38.94,24.08 38.3,24.71 38.3,26.49 v38.79,26.98
  Top 0.508: 17.78,10.03 L1.2 16.98,9.53 C9.1
  Bottom 0.127: UC.15 24.2,26.22 C4.1 26.07,26.01 v28.63,26.01 | UC.25 27.3,20.7 27.69,20.32 C1.1 27.69,19.58 29.27,18 R22.1 29.25,17.7 29.03,17.7 28.85,17.53 28.85,16.18 v28.75,16.08 | UC.45 18.7,15.53 17.16,13.98 C2.1 16,13.87 12.39,10.26 12.39,9.47 v12.52,9.35 | UC.35 23.7,14.6 25.67,12.63 25.67,12.56 C3.1 25.78,12.57 26.04,12.83 26.67,12.83 | UC.53 15.25,19.2 C5.1 15,19.13 | A2.14 10.72,19.61 11,19.89 v12.47,19.89 | Z2.15 12.8,22.31 v12.8,21.16 | v9.53,23.04 9.3,22.82 Z2.2 8.51,22.73 7.85,22.73 4.78,19.66 v4.5,19.66 | R23.1 28.37,11.61 30.23,9.75 v30.76,9.75 32.16,9.75 33.43,11.02 33.43,12.72 Z1.15 | 15,19.13 14.93,19.2 | v16.99,36.93 17.04,36.98 v19.84,36.98 | v12.52,9.35 v16.15,9.35 19.96,13.16 v19.96,13.31 | 28.35,12.56 R23.1 | 26.67,12.83 28.09,12.83 28.35,12.57 R23.1 | v26.64,12.34 26.64,12.8 26.67,12.83 | v23.04,15.6 v23.04,14.71 | A1.14 34.77,20.8 36.67,22.7 R4.2 37.98,22.7 v38.28,22.4 | v27.33,28.68 v27.33,33.48 33.5,33.48 38.79,28.19 v38.79,26.98 | 15,19.13 v14.22,19.13 | v12.52,9.35 12.01,9.35 10.87,10.49 5.74,10.49 2.82,13.41 v2.82,13.89 | P2.3B 22.23,42.85
  pour Bottom (isolate 0.178): 0.38,20.95 0.38,21.08 arc-90 20.95,41.66 arc-90 41.66,20.95 arc-90 21.08,0.38 20.95,0.38 arc-90
VIN  (via drill 0.2)  (1 unrouted)
  Top 0.127: C27.1 5.56,28.67 v5.56,27.56 | 10.75,17.13 10.75,17.12 V2.6 | v8.79,33.78 8.87,33.71 10.49,33.71 10.87,34.09 15.65,34.09 v17.4,35.84 19.66,38.1 19.66,41.88 P2.1B 19.68,42.8
  Top 0.508: V2.3 8.78,15.2 9.47,15.9 9.47,16.41 10.17,17.1 V2.6
  Top 0.635: L3.1 10.75,17.13
  Top 0.762: C25.1 D1.C 37.5,26.17 35.71,24.38 35.71,14.38 32.29,10.96 24.89,10.96 | C27.1 D5.C 4.41,26.73 9,22.14 | C26.1 D3.C 24.89,4.71 24.89,10.96 | 24.89,10.96 C.P 20.37,11.54 20.37,11.73 18.77,13.34 15.57,13.34 11.8,17.1 V2.6 | 9,22.14 10.67,20.47 10.67,19.86 10.77,19.76 10.77,19.58 L3.1 | C11.1 8.96,22.14 9,22.14
  Bottom 0.127: v5.56,27.56 5.56,27.79 8.79,31.01 v8.79,33.78 | R34.2 24.41,32.88 24.41,34.85 23.42,35.84 v17.4,35.84 | P2.1B 19.68,42.8
VIN_SEN
  Bottom 0.127: R33.2 C30.1 R34.1 25.06,32.07 24.79,31.8 | 24.79,31.8 24.79,31.11 20.2,26.53 UC.7 | 24.79,31.83 24.79,31.8
VREF_HI
  Bottom 0.127: R35.1 R36.2 C24.1 14.45,25.32 16.07,23.7 UC.62
VREF_IN
  Bottom 0.127: R40.2 C29.1 R39.1 20.74,32.11 19.56,32.11 18.87,31.42 18.87,27.96 19.7,27.13 UC.6
VREF_LO  (via drill 0.2)
  Top 0.127: v15.11,25.86 15.11,28.12 16.13,29.13 v16.33,29.13
  Bottom 0.127: R37.1 C28.1 R38.2 16.75,31.95 16.74,31.95 16.74,29.54 v16.33,29.13 | UC.63 15.95,24.2 15.11,25.04 v15.11,25.86
XCKD1  (via drill 0.2)  (1 unrouted)
  Top 0.127: MEM.5 33.66,23.52 33.83,23.34 33.83,22.25 34.37,21.72 34.37,19.89 v34.19,19.71 33.02,19.71 31.93,20.8 29.21,20.8 27.1,18.69 27.1,18.44 26.67,18.01 v26.67,17.75 | v37.69,22.05 37.29,21.64 37.29,14.03 P3.3B 40.19,11.12 40.49,11.12
  Bottom 0.127: UC.31 25.43,17.75 v26.67,17.75 | v37.69,22.05 36.4,22.05 34.19,19.84 v34.19,19.71 | 40.49,11.12 40.03,11.58 P3.3B

### Text on the board
tPlace: VIN | GND | VCC | DROPLET | XCK | CLK | RX | DATA | TX